# EAGLE schematic tutorial2 (EAGLE 9.5.1)
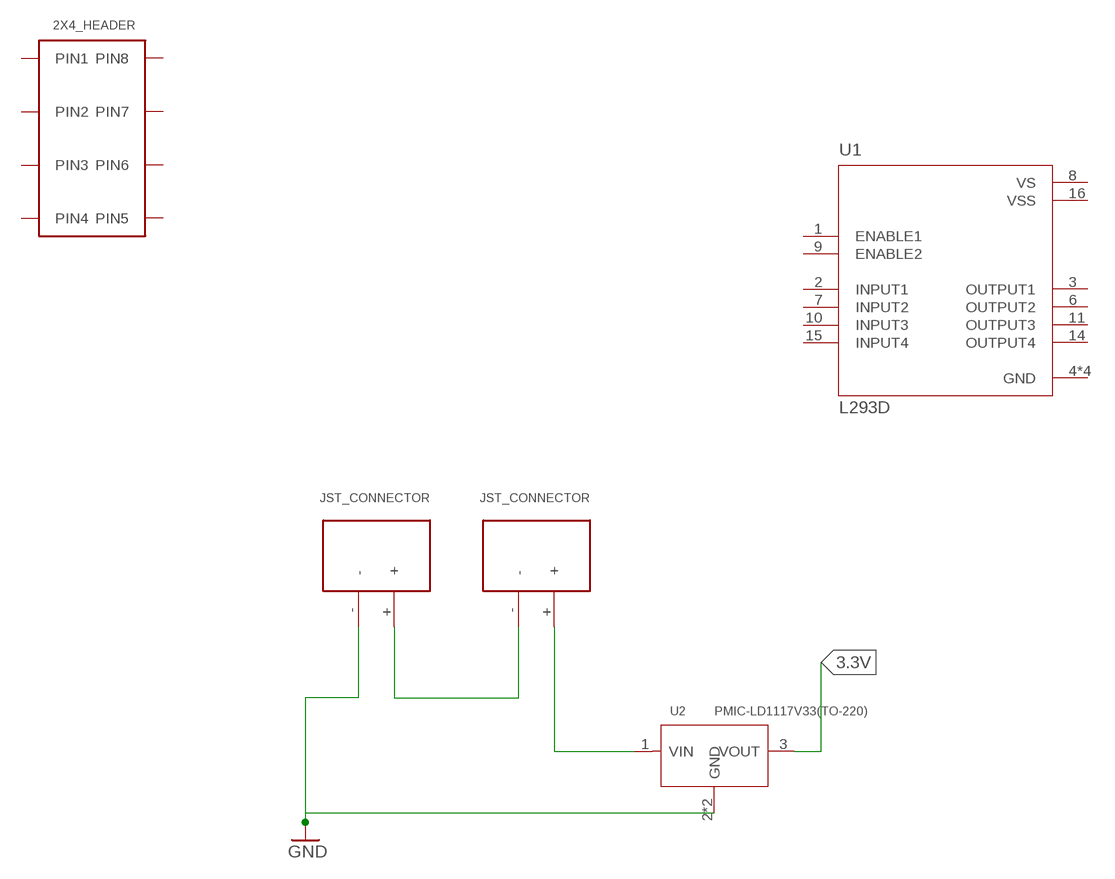
[diagram p0: schematic, sheet 1]

## Parts
U1  L293D  [DIP880W50P254L2000H510Q16]
U2  PMIC-LD1117V33(TO-220)  [TO-220]
U$1  JST_CONNECTOR_FEMALE.-THROUGH-HOLE_JST_CONNECTOR_FEMALE  [JST_CONNECTOR_FEMALE.-THROUGH-HOLE_JST_CONNECTOR_FEMALE]
U$2  JST_CONNECTOR_FEMALE.-THROUGH-HOLE_JST_CONNECTOR_FEMALE  [JST_CONNECTOR_FEMALE.-THROUGH-HOLE_JST_CONNECTOR_FEMALE]
U$3  2X3_HEADER  [2X3_HEADER]

## Nets
3.3V: U2.3(VOUT)
GND: U2.2(GND) U2.HEAT(GND) U$1.-
N$1: U$1.+ U$2.-
N$2: U2.1(VIN) U$2.+
Unconnected: U1.1(ENABLE1) U1.2(INPUT1) U1.3(OUTPUT1) U1.6(OUTPUT2) U1.7(INPUT2) U1.9(ENABLE2) U1.10(INPUT3) U1.11(OUTPUT3) U1.14(OUTPUT4) U1.15(INPUT4) U$3.PIN1 U$3.PIN2 U$3.PIN3 U$3.PIN4 U$3.PIN5 U$3.PIN6 U$3.PIN7 U$3.PIN8

## Power pins joined to a net without a drawn wire
GND: U1.4(GND) U1.5(GND) U1.12(GND) U1.13(GND)
VS: U1.8(VS)
VSS: U1.16(VSS)

## Library data of the parts
U1 = L293D:L293D: 4-Channel Motor Driver 24V 16-Pin Power PDIP Tube; AVAILABILITY: Unavailable; DESCRIPTION: 4-Channel Motor Driver 24V 16-Pin Power PDIP Tube; MF: STMicroelectronics; MP: L293D; PACKAGE: DIP-16 STMicroelectronics; PRICE: None
U2 = PMIC-LD1117V33_TO-220_:PMIC-LD1117V33(TO-220): 310030025; AVAILABILITY: Unavailable; DESCRIPTION: LD1117 Series 3.3 V 800 mA Low Drop Fixed Positive Voltage Regulator - TO-220; MF: STMicroelectronics; MP: LD1117V33; PACKAGE: TO-220 STMicroelectronics; PRICE: None
U$1 U$2 = MM2019Libv3:JST_CONNECTOR_FEMALE.-THROUGH-HOLE_JST_CONNECTOR_FEMALE
U$3 = MM2019Libv3:2X3_HEADER